# Altium project master.PrjPcb (part 3 of 3)

## Sheet isolated_rs485.SchDoc: foxBMS BMS-Extension
size A3; DocumentNumber: 9; SheetNumber: 9; SheetTotal: 14; Author: Fraunhofer IISB foxBMS Team; REL-DATE: 2017-05-16; VERSION: 1.0.2; GateName_1: G$1; SymbolName_1: FRAME_B_L; LibraryName: foxBMS_BMS-Master_V1.00_A; DeviceSetName: FRAME_B_L; GateName_2: G$2; SymbolName_2: DOCFIELD; SheetDescription: Isolated RS485
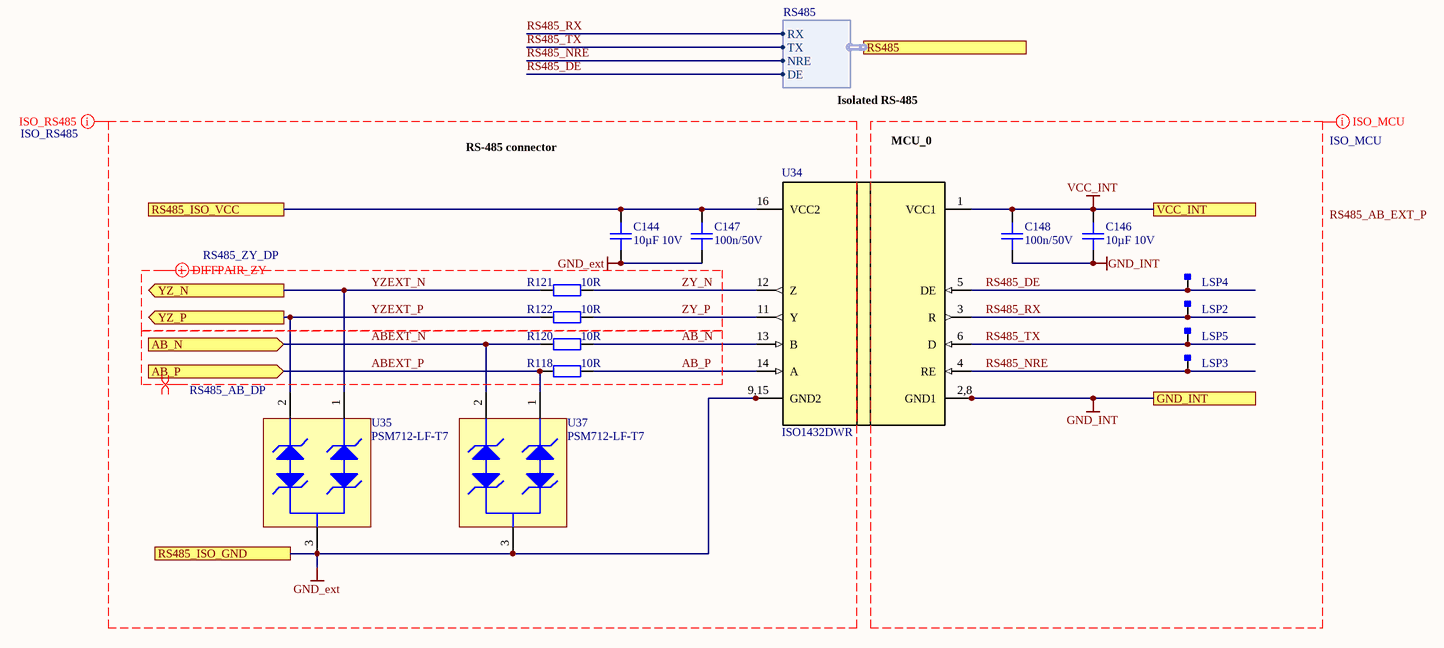
[diagram p13: isolated_rs485.SchDoc]

### Parts
C144  10µF 10V  [0805C]
C146  10µF 10V  [0805C]
C147  100n/50V  [0603C]
C148  100n/50V  [0603C]
LSP2  Testpoint_Square  [Testpoint_S1]  (value not drawn)  (no BOM)
LSP3  Testpoint_Square  [Testpoint_S1]  (value not drawn)  (no BOM)
LSP4  Testpoint_Square  [Testpoint_S1]  (value not drawn)  (no BOM)
LSP5  Testpoint_Square  [Testpoint_S1]  (value not drawn)  (no BOM)
R118  10R  [0603R]
R120  10R  [0603R]
R121  10R  [0603R]
R122  10R  [0603R]
U34  ISO1432DWR  [DW0016B_N]
U35  PSM712-LF-T7  [PRKT-SOT23-3_V]
U37  PSM712-LF-T7  [PRKT-SOT23-3_V]

### Ports
AB_N (in), AB_P (in), GND_INT, RS485 (harness RS485), RS485_ISO_GND, RS485_ISO_VCC, VCC_INT, YZ_N (out), YZ_P (out)

### Harnesses
RS485: RX, TX, NRE, DE

### Nets
+3.3V_COM: C144.1 C147.1 U34.16(VCC2) ; port RS485_ISO_VCC
GND_ext: C144.2 C147.2 U34.9,15(GND2) U34.15 U35.3 U37.3 ; port RS485_ISO_GND  [project net GND_COM]
GND_INT: C146.2 C148.2 U34.2,8(GND1) U34.8 ; port GND_INT  [project net GND_0]
VCC_INT: C146.1 C148.1 U34.1(VCC1) ; port VCC_INT  [project net +3.3V_0]
AB_N: R120.2 U34.13(B)
AB_P: R118.2 U34.14(A)
ABEXT_N: R120.1 U37.2 ; port AB_N
ABEXT_P: R118.1 U37.1 ; port AB_P
RS485_DE: LSP4.1 U34.5(DE) ; port RS485.DE
RS485_NRE: LSP3.1 U34.4(RE) ; port RS485.NRE  [project net RS485_MCU_0_NRE]
RS485_RX: LSP2.1 U34.3(R) ; port RS485.RX  [project net RS485_MCU_0_RX]
RS485_TX: LSP5.1 U34.6(D) ; port RS485.TX  [project net RS485_MCU_0_TX]
YZEXT_N: R121.1 U35.1 ; port YZ_N  [project net RS485_YZ_N]
YZEXT_P: R122.1 U35.2 ; port YZ_P  [project net RS485_YZ_P]
ZY_N: R121.2 U34.12(Z)
ZY_P: R122.2 U34.11(Y)

Not connected (* = marked no-connect by the designer): U34 7(NC) 10(NC)

### Layout directives
net class ISO_MCU: GND_INT, RS485_DE, RS485_NRE, RS485_RX, RS485_TX, VCC_INT
net class ISO_RS485: AB_N, AB_P, ABEXT_N, ABEXT_P, GND_ext, YZEXT_N, YZEXT_P, ZY_N, ZY_P
differential pair; differential pair class RS485_ZY_DP: YZEXT_N, YZEXT_P, ZY_N, ZY_P
differential pair; differential pair class RS485_AB_DP: AB_N, AB_P, ABEXT_N, ABEXT_P

### Notes on the sheet
- Isolated RS-485
- RS-485 connector
- MCU_0
- Labels drawn without touching a wire or pin: RS485_AB_EXT_P
- Fraunhofer IISB
- Schottkystr. 10
- developed by:
- 91058 Erlangen
- Germany
- Author
- Project
- License
- Description
- File
- Version
- Release Date
- Sheet
- www.foxbms.org
- www.iisb.fraunhofer.de
- foxBMS Team
- /

### Library data of the parts
C144 C146 = gen_C_ceramic_10u_10V_X7R_0805: Ceramic, 10µF, ±10%, 10V, X7R, –55 to 125°C, 0805 (2012),RoHS, Automotive; Part Number: GCJ21BR71A106KE01; Manufacturer: Murata; Case EIA: 0805; Case Metric: 2012; Automotive Qualified: True; PnP Package: C_0805_10; PnP Value: 10µF/10V/X7R; Capacitance: 10µF; Rated Voltage: 10V; Dielectric: X7R; Supplier 1: Digi-Key; Supplier Part Number 1: 490-12646-1-ND; Height - Seated (Max): 1.25mm; Mounting Type: SurfaceMount,MLCC; Operating Temperature: –55 to 125°C; Series: GCJ; Tolerance: ±10%; Manufacturer_Part_Number: GCJ21BR71A106KE01
C147 C148 = gen_C_ceramic_100n_50V_X7R_0603: MLCC; Capacitance: 100n; Rated Voltage: 50V; Dielectric: X7R; Case EIA: 0603; Case Metric: 1608; PnP Package: C_0603_10; PnP Value: 100n/50V/X7R; PnP equipped: x; Part Number: gen_C_ceramic_100n_50V_X7R_0603; Supplier 1: Farnell; Supplier Part Number 1: 2525267
LSP2-LSP5 = Testpoint_Square: Testpoint, square; Part Number: Testpoint_Square
R118 R120-R122 = gen_R_10R_0603: SMD Resistor 10R 0603; Tolerance: 1%; Power: 0.1W; Case EIA: 0603; Case Metric: 1608; Maximum Working Voltage: 75V; PnP Package: R_0603; Automotive Qualified: False; Part Number: gen_R_10R_0603; Operating Temperature: -55°C - +155°C; Resistance: 10R; Series: E24, E96; PnP Value: 10R; Supplier 1: Farnell; Supplier Part Number 1: 2073361
U34 = ISO1432DWR: 5-kVrms isolated RS-485/RS-422 transceiver with robust EMC; Manufacturer: Texas Instruments; PartNumber: ISO1432DWR; RefDes: RefDes; TYPE: TYPE; Value: Value; Part Number: ISO1432DWR
U35 U37 = CMP-2000-07553-1: TVS Array - Asymmetrical Data Line Protector, 600 W, 7.5 V, -55 to 150 degC, 3-Pin SOT23, RoHS, Tape and Reel; Manufacturer: Protek Devices; Min Breakdown Voltage: 7.5V; Direction: Bidirectional; Capacitance: 75pF; Current: 20uA; Power Dissipation: 600W; Working Voltage: 7V; Voltage: 12V; Case\/Package: SOT-23; Clamping Voltage: 17V; Element Configuration: Dual; Mounting Technology: SurfaceMount; RoHSCompliant: True; Radiation Hardening: No; Depth: 1.4mm; Lead Free: LeadFree; Package Description: 3-Pin Small Outline Transistor, Body 2.92 x 1.3 mm, Pitch 0.94 mm; Max Operating Temperature: 150degC; Length: 3.04mm; Manufacturer URL: http://www.protekdevices.com/; Min Operating Temperature: -55degC; Leakage Current: 20uA; Datasheet URL: www.protekdevices.com/xyz/documents/datasheets/psm712.pdf; Packaging: TapeandReel; Datasheet Version: 10/2013; Package Reference: SOT23-3; Number of Pins: 3

## Sheet dcdc_wide_3v3.SchDoc
size 379 x 125 mm; SheetNumber: 1; SheetTotal: 1
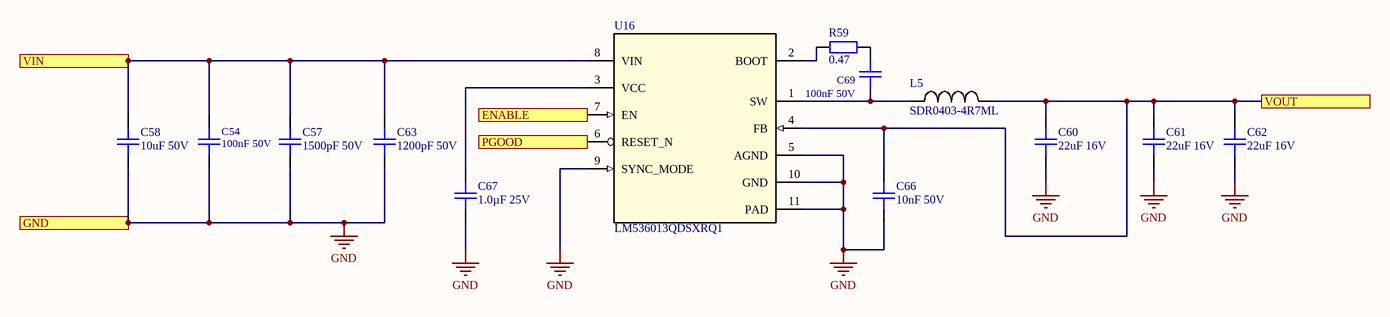
[diagram p14: dcdc_wide_3v3.SchDoc]

### Parts
C54  100nF 50V  [0805C]
C57  1500pF 50V  [0402C]
C58  10uF 50V  [CAPC3225X279X50LL20T25]
C60  22uF 16V  [1210C]
C61  22uF 16V  [1210C]
C62  22uF 16V  [1210C]
C63  1200pF 50V  [0402C]
C66  10nF 50V  [0402C]
C67  1.0µF 25V  [0603C]
C69  100nF 50V  [0805C]
L5  SDR0403-4R7ML  [SDR0403]
R59  0.47  [0402R]
U16  LM536013QDSXRQ1  [DSX0010A]

### Ports
ENABLE, GND, PGOOD, VIN, VOUT

### Nets
GND: C54.1 C57.1 C58.1 C60.1 C61.1 C62.1 C63.1 C66.1 C67.1 U16.5(AGND) U16.9(SYNC_MODE) U16.10(GND) U16.11(PAD) ; port GND
NetC54_2: C54.2 C57.2 C58.2 C63.2 U16.8(VIN) ; port VIN
NetC60_2: C60.2 C61.2 C62.2 C66.2 L5.2 U16.4(FB) ; port VOUT
NetC67_2: C67.2 U16.3(VCC)
NetC69_1: C69.1 L5.1 U16.1(SW)
NetC69_2: C69.2 R59.2
NetR59_1: R59.1 U16.2(BOOT)
NetU16_6: U16.6(RESET_N) ; port PGOOD
NetU16_7: U16.7(EN) ; port ENABLE

### Library data of the parts
C54 = gen_C_ceramic_100n_50V_X7R_0805: Ceramic, 100nF, ±20%, 50V, X7R, –55 to 125°C, 0805 (2012),RoHS, Automotive; Manufacturer: Murata; Capacitance: 100n; Case EIA: 0805; Case Metric: 2012; Automotive Qualified: True; PnP Package: C_0805_10; Tolerance: ±10%; Dielectric: X7R; Rated Voltage: 50V; Height - Seated (Max): 0.8mm; Mounting Type: SurfaceMount,MLCC; Operating Temperature: –55 to 125°C; Series: GCJ; Supplier 1: Element14; Supplier Part Number 1: 8820120
C57 = gen_C_ceramic_390p_25V_C0G_0402: Ceramic, 390pF, ±5%, 25V, C0G, 25 to 125°C, 0402 (1005),RoHS, Automotive; Manufacturer: Murata; Capacitance: 1500p; Case EIA: 0402; Case Metric: 1005; Automotive Qualified: True; PnP Package: C_0402_10; PnP Value: 1500p/50V/C0G; Rated Voltage: 50V; Dielectric: C0G; Supplier 1: Digi-Key; Height - Seated (Max): 0.5mm; Mounting Type: SurfaceMount,MLCC; Operating Temperature: 25 to 125°C; Series: GCM; Tolerance: ±5%
C58 = gen_C_ceramic_10u_50V_X7R_1210: Ceramic, 10uF, 50 V, -55 to 125 degC, 2-Pin SMD (1210), RoHS, Tape and Reel; Manufacturer: AVX; Manufacturer 1: Kyocera AVX; Manufacturer Part Number 1: 12105C106KAT2A; Dielectric: X7R; Tolerance: ±10%; Load Life: 1000h; Type: CommercialSurfaceMountChip; Temperature Coefficient / Code: +/-15%; Case EIA: 1210; Case Metric: 3225; PnP Package: C_1210_10; PnP Value: 10µF/25V/X7R; Rated Voltage: 25V; Maximum Operating Temperature: +125C; Mounting Technology: SurfaceMount; Case Code - in: 1210; Package Description: 2-Pin Surface Mount Device, Body 3.2 x 2.5 mm; Datasheet URL: http://www.farnell.com/datasheets/1818074.pdf; Case Code - mm: 3225; Package / Case: 1210(3225metric); Product: GeneralTypeMLCCs; Capacitance: 10uF; Product Category: MultilayerCeramicCapacitorsMLCC-SMD/SMT; Minimum Operating Temperature: -55C; Manufacturer URL: http://www.avx.com/; Operating Temperature Range: -55Cto+125C; Termination Style: SMD/SMT; Voltage Rating: 50V; Factory Pack Quantity: 1000; RoHS: Details; Brand: AVX; Datasheet Version: 03/2014; Package Reference: 1210; Packaging: Reel; Voltage Rating DC: 50V; Height - Seated (Max): 2.5mm; Mounting Type: SurfaceMount,MLCC; Operating Temperature: –55 to 125°C; Series: GCM
C60-C62 = gen_C_ceramic_22u_16V_X7R_1210: Ceramic, 22uF, 16 V, -55 to 125 degC, 2-Pin SMD (1210), RoHS, Tape and Reel; Manufacturer: AVX; Manufacturer 1: Kyocera AVX; Manufacturer Part Number 1: 12105C106KAT2A; Dielectric: X7R; Tolerance: ±10%; Capacitance: 10uF; Load Life: 1000h; Type: CommercialSurfaceMountChip; Voltage Rating: 50V; Temperature Coefficient / Code: +/-15%; Case EIA: 1210; Case Metric: 3225; PnP Package: C_1210_10; PnP Value: 22µF/16V/X7R; Maximum Operating Temperature: +125C; Mounting Technology: SurfaceMount; Case Code - in: 1210; Package Description: 2-Pin Surface Mount Device, Body 3.2 x 2.5 mm; Datasheet URL: http://www.farnell.com/datasheets/1818074.pdf; Case Code - mm: 3225; Package / Case: 1210(3225metric); Product: GeneralTypeMLCCs; Product Category: MultilayerCeramicCapacitorsMLCC-SMD/SMT; Minimum Operating Temperature: -55C; Manufacturer URL: http://www.avx.com/; Operating Temperature Range: -55Cto+125C; Termination Style: SMD/SMT; Factory Pack Quantity: 1000; RoHS: Details; Brand: AVX; Datasheet Version: 03/2014; Package Reference: 1210; Packaging: Reel; Voltage Rating DC: 50V; Height - Seated (Max): 2.5mm; Mounting Type: SurfaceMount,MLCC; Operating Temperature: –55 to 125°C; Rated Voltage: 16V; Series: GCM
C63 = gen_C_ceramic_390p_25V_C0G_0402: Ceramic, 390pF, ±5%, 50V, C0G, 25 to 125°C, 0402 (1005),RoHS, Automotive; Manufacturer: Murata; Capacitance: 1200p; Case EIA: 0402; Case Metric: 1005; Automotive Qualified: True; PnP Package: C_0402_10; PnP Value: 1200pF/50V/C0G; Rated Voltage: 50V; Dielectric: C0G; Supplier 1: Digi-Key; Height - Seated (Max): 0.5mm; Mounting Type: SurfaceMount,MLCC; Operating Temperature: 25 to 125°C; Series: GCM; Tolerance: ±5%
C66 = gen_C_ceramic_10n_50V_X7R_0402: Ceramic, 10nF, ±10%, 50V, X7R, –55 to 125°C, 0402 (1005),RoHS, Automotive; Part Number: GRT155R71H104KE01; Automotive Qualified: True; Capacitance: 10n; Case EIA: 0402; Case Metric: 1005; PnP Package: C_0402_10; PnP Value: 10n/50V/X7R; Dielectric: X7R; Rated Voltage: 50V
C67 = gen_C_ceramic_1u_25V_X7R_0603: Ceramic, 1.0µF, ±10%, 25V, X7R, –55 to 125°C, 0603 (1608),RoHS, Automotive; Part Number: GCJ188R71E105KA01; Manufacturer: Murata; Case EIA: 0603; Case Metric: 1608; Capacitance: 1µF; Automotive Qualified: True; PnP Package: C_0603_10; PnP Value: 1.0µF/25V/X7R; Dielectric: X7R; Rated Voltage: 25V; Height - Seated (Max): 0.8mm; Mounting Type: SurfaceMount,MLCC; Operating Temperature: –55 to 125°C; Series: GCJ; Tolerance: ±10%; Manufacturer_Part_Number: GCJ188R71E105KA01; Supplier 1: Digi-Key; Supplier Part Number 1: 490-14409-1-ND
C69 = gen_C_ceramic_100n_50V_X7R_0805: Ceramic, 100nF, ±20%, 50V, X7R, –55 to 125°C, 0805 (2012),RoHS, Automotive; Part Number: GCJ188R71H104KA12; Manufacturer: Murata; Capacitance: 100n; Case EIA: 0603; Case Metric: 1608; Automotive Qualified: True; PnP Package: C_0603_10; PnP Value: 100nF/50V/X7R; Tolerance: ±10%; Dielectric: X7R; Rated Voltage: 50V; Height - Seated (Max): 0.8mm; Mounting Type: SurfaceMount,MLCC; Operating Temperature: –55 to 125°C; Series: GCJ; Manufacturer_Part_Number: GCJ188R71H104KA12; Supplier 1: Digi-Key; Supplier Part Number 1: 490-5798-1-ND
L5 = SDR0403-4R7ML: 4.7uH; Vendor: Bourns; Manufacturer_Part_Number: SDR0403-4R7ML; Manufacturer_Name: Bourns; RefDes: RefDes; TYPE: TYPE; Value: Value
R59 = gen_R_0R_0402: SMD Resistor 0R47 0402; Part Number: gen_R_0R47_0402; Case EIA: 0402; Case Metric: 1005; PnP Package: R_0402; Automotive Qualified: False; PnP Value: 0R47; Operating Temperature: -55°C - +155°C
U16 = LM536013QDSXRQ1: Imported; Manufacturer: Texas Instruments; CompType: IC; PIN_COUNT: 11; Application_BuildNumber: *; PartNumber: LM536013QDSXRQ1; PackageReference: DSX0010A; MountType: SMT; RoHS: Y; RefDes: RefDes; TYPE: TYPE; Value: Value; Manufacturer_Part_Number: LM536013QDSXRQ1; Manufacturer_Name: Texas Instruments

## Sheet bms-slave-magnetics.SchDoc: foxBMS BMS-Interface
size A3; DocumentNumber: 4; SheetNumber: 4; SheetTotal: 6; Author: Fraunhofer IISB foxBMS Team; REL-DATE: 2017-05-09; VERSION: 1.1.0; GateName_1: G$1; SymbolName_1: FRAME_B_L; LibraryName: foxBMS_BMS-Master_V1.00_A; DeviceSetName: FRAME_B_L; GateName_2: G$2; SymbolName_2: DOCFIELD; SheetDescription: Daisy Chain Isolation
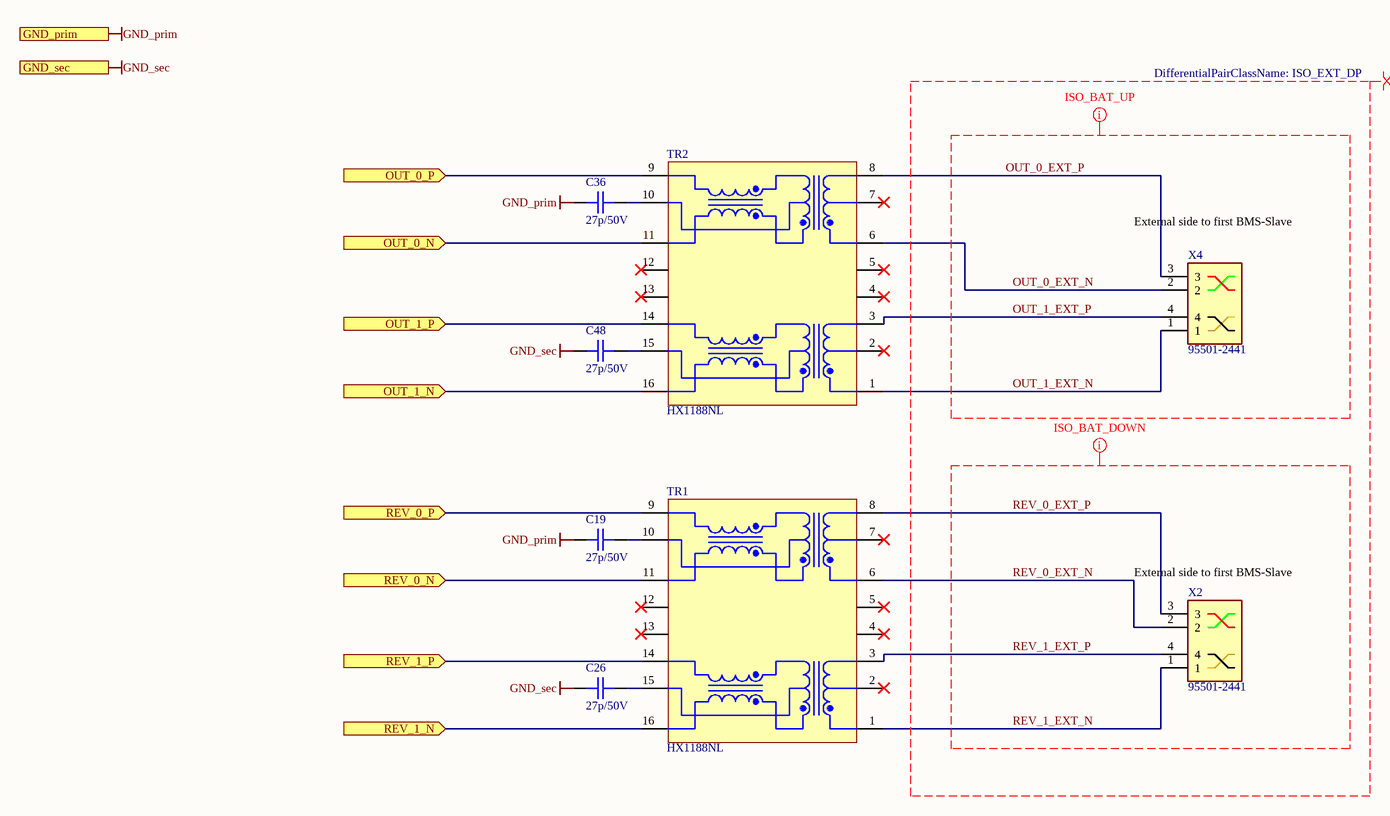
[diagram p15: bms-slave-magnetics.SchDoc]

### Parts
C19  27p/50V  [0603C]
C26  27p/50V  [0603C]
C36  27p/50V  [0603C]
C48  27p/50V  [0603C]
TR1  HX1188NL  [PULS-MODULE-16_V]
TR2  HX1188NL  [PULS-MODULE-16_V]
X2  95501-2441  [95501-2441]
X4  95501-2441  [95501-2441]

### Ports
GND_prim, GND_sec, OUT_0_N (in), OUT_0_P (in), OUT_1_N (in), OUT_1_P (in), REV_0_N (in), REV_0_P (in), REV_1_N (in), REV_1_P (in)

### Nets
GND_prim: C19.2 C36.2 ; port GND_prim
GND_sec: C26.1 C48.1 ; port GND_sec
OUT_0_EXT_N: TR2.6 X4.2
OUT_0_EXT_P: TR2.8 X4.3
OUT_1_EXT_N: TR2.1 X4.1
OUT_1_EXT_P: TR2.3 X4.4
REV_0_EXT_N: TR1.6 X2.2
REV_0_EXT_P: TR1.8 X2.3
REV_1_EXT_N: TR1.1 X2.1
REV_1_EXT_P: TR1.3 X2.4
NetC19_1: C19.1 TR1.10
NetC26_2: C26.2 TR1.15
NetC36_1: C36.1 TR2.10
NetC48_2: C48.2 TR2.15
NetTR1_9: TR1.9 ; port REV_0_P
NetTR1_11: TR1.11 ; port REV_0_N
NetTR1_14: TR1.14 ; port REV_1_P
NetTR1_16: TR1.16 ; port REV_1_N
NetTR2_9: TR2.9 ; port OUT_0_P
NetTR2_11: TR2.11 ; port OUT_0_N
NetTR2_14: TR2.14 ; port OUT_1_P
NetTR2_16: TR2.16 ; port OUT_1_N

Not connected (* = marked no-connect by the designer): TR1 2* 4* 5* 7* 12* 13*; TR2 2* 4* 5* 7* 12* 13*

### Layout directives
net class ISO_BAT; net class ISO_BAT_UP: OUT_0_EXT_N, OUT_0_EXT_P, OUT_1_EXT_N, OUT_1_EXT_P
net class ISO_BAT; net class ISO_BAT_DOWN: REV_0_EXT_N, REV_0_EXT_P, REV_1_EXT_N, REV_1_EXT_P
differential pair; differential pair class ISO_EXT_DP: OUT_0_EXT_N, OUT_0_EXT_P, OUT_1_EXT_N, OUT_1_EXT_P, REV_0_EXT_N, REV_0_EXT_P, REV_1_EXT_N, REV_1_EXT_P

### Notes on the sheet
- (near X4) External side to first BMS-Slave
- (near X2) External side to first BMS-Slave
- Fraunhofer IISB
- Schottkystr. 10
- developed by:
- 91058 Erlangen
- Germany
- Author
- Project
- License
- Description
- File
- Version
- Release Date
- Sheet
- www.foxbms.org
- www.iisb.fraunhofer.de
- foxBMS Team
- /

### Library data of the parts
C19 C26 C36 C48 = gen_C_ceramic_27p_50V_NP0_0603: MLCC; Capacitance: 27p; Rated Voltage: 50V; Dielectric: NP0; Case EIA: 0603; Case Metric: 1608; PnP Package: C_0603_05; Automotive Qualified: True; Part Number: gen_C_ceramic_27p_50V_NP0_0603; Supplier 1: Farnell; Supplier Part Number 1: 2219430; PnP Value: *
TR1 TR2 = CMP-2000-05323-1: 10/100 Base-T Single Port Surface Mount Magnetic with Turns Ratio, -40 to 85 degC, 16-Pin Module, RoHS, Tube; Manufacturer: Pulse Electronics; Other Related Documents: PackagesFNLvs.NL; Other Names: 553-1340; PCN Design/Specification: ThermoplasticHeaderDesign28/Jun/2013; Transformer Type: IsolationandDataInterface(Encapsulated); PCN Other: HaloInjunctionRes1/Sep/2015; Turns Ratio - Primary: Secondary:1:1Transmitter,1:1Receiver; Family: PulseTransformers; Datasheet URL: https://datasheet.ciiva.com/26929/hx1188nl-26929858.pdf; Mounting Type: SurfaceMount; Size / Dimension: 12.70mmLx7.11mmW; Inductance: -; Package Description: 16-Pin Surface Mount Device, Body 12.7 x 7.11 mm, Pitch 1.27 mm; Height - Seated (Max): 6.22mm; E.T.: -; Online Catalog: 10/100BASE-TSinglePort; Manufacturer URL: http://www.pulseelectronics.com/; Package Reference: MODULE-16; Series: -; Category: Transformers; Standard Package: 40; Datasheet Version: Rev. H325.Q, 09/2009
X2 X4 = 95501-2441: Connector; Manufacturer_Name: Molex; Allied_Number: 70372436; Datasheet Link: http://www.molex.com/webdocs/datasheets/pdf/en-us/0955012441_MODULAR_JACKS_PLUG.pdf; Manufacturer_Part_Number: 95501-2441; Mouser Part Number: 538-95501-2441; Mouser Price/Stock: https://www.mouser.com/Search/Refine.aspx?Keyword=538-95501-2441; RS Part Number: 2400913; RS Price/Stock: https://uk.rs-online.com/web/p/products/2400913; Allied Price/Stock: http://www.alliedelec.com/molex-incorporated-95501-2441/70372436/

## Sheet 0301_LTC6820_chip.SchDoc
size A3; DocumentNumber: 6; SheetNumber: 6; SheetTotal: 6; SheetDescription: LTC6820
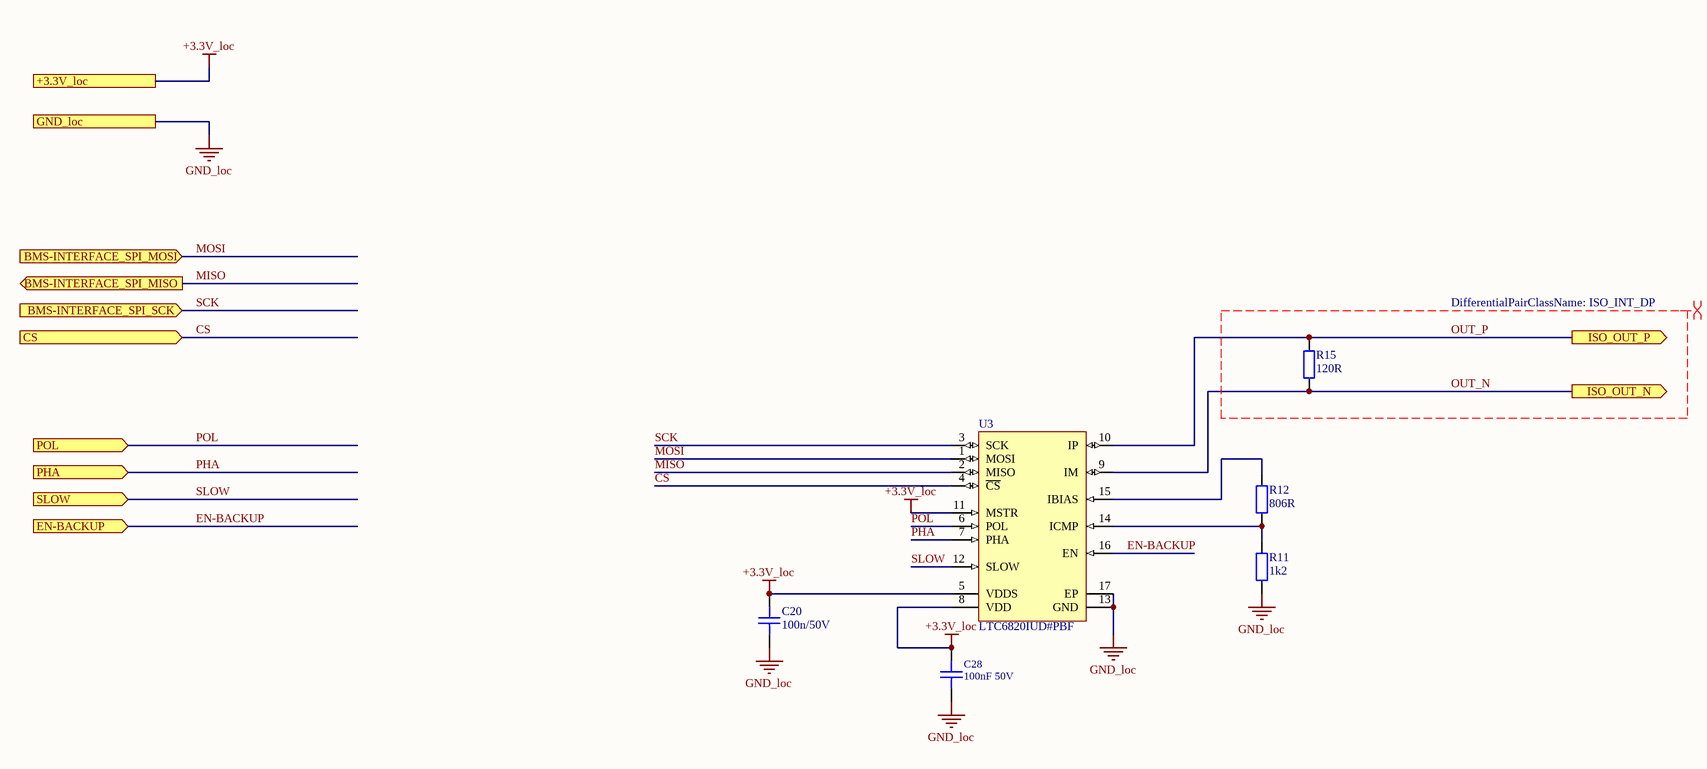
[diagram p16: 0301_LTC6820_chip.SchDoc]

### Parts
C20  100n/50V  [0603C]
C28  100nF 50V  [0603C]
R11  1k2  [0603R]
R12  806R  [0603R]
R15  120R  [0603R]
U3  LTC6820IUD#PBF  [LT-UD-16-EPV-AA_L]

### Ports
+3.3V_loc, BMS-INTERFACE_SPI_MISO (out), BMS-INTERFACE_SPI_MOSI (in), BMS-INTERFACE_SPI_SCK (in), CS (in), EN-BACKUP (in), GND_loc, ISO_OUT_N (out), ISO_OUT_P (out), PHA (in), POL (in), SLOW (in)

### Nets
+3.3V_loc: C20.2 C28.2 U3.5(VDDS) U3.8(VDD) U3.11(MSTR) ; port +3.3V_loc
GND_loc: C20.1 C28.1 R11.1 U3.13(GND) U3.17(EP) ; port GND_loc
CS: U3.4(~{CS}) ; port CS
EN-BACKUP: U3.16(EN) ; port EN-BACKUP
MISO: U3.2(MISO) ; port BMS-INTERFACE_SPI_MISO
MOSI: U3.1(MOSI) ; port BMS-INTERFACE_SPI_MOSI
OUT_N: R15.1 U3.9(IM) ; port ISO_OUT_N
OUT_P: R15.2 U3.10(IP) ; port ISO_OUT_P
PHA: U3.7(PHA) ; port PHA
POL: U3.6(POL) ; port POL
SCK: U3.3(SCK) ; port BMS-INTERFACE_SPI_SCK
SLOW: U3.12(SLOW) ; port SLOW
NetR11_2: R11.2 R12.1 U3.14(ICMP)
NetR12_2: R12.2 U3.15(IBIAS)

### Layout directives
differential pair; differential pair class ISO_INT_DP: OUT_N, OUT_P

### Notes on the sheet
- Fraunhofer IISB
- Schottkystr. 10
- developed by:
- 91058 Erlangen
- Germany
- Author
- Project
- License
- Description
- File
- Version
- Release Date
- Sheet
- www.foxbms.org
- www.iisb.fraunhofer.de
- foxBMS Team
- /

### Library data of the parts
C20 = gen_C_ceramic_100n_50V_X7R_0603: MLCC; Capacitance: 100n; Rated Voltage: 50V; Dielectric: X7R; Case EIA: 0603; Case Metric: 1608; PnP Package: C_0603_10; PnP Value: 100n/50V/X7R; PnP equipped: x; Automotive Qualified: True; Part Number: gen_C_ceramic_100n_50V_X7R_0603; Supplier 1: Farnell; Supplier Part Number 1: 2525267; Supplier 2: Digikey; Supplier Part Number 2: 490-6049-1-ND; Supplier 3: Farnell; Supplier Part Number 3: 2070398
C28 = gen_C_ceramic_100n_50V_X7R_0603: Ceramic, 100nF, ±10%, 50V, X7R, –55 to 125°C, 0603 (1608),RoHS, Automotive; Part Number: GCJ188R71H104KA12; Manufacturer: Murata; Capacitance: 100n; Case EIA: 0603; Case Metric: 1608; PnP Package: C_0603_10; PnP Value: 100nF/50V/X7R; Automotive Qualified: True; Rated Voltage: 50V; Dielectric: X7R; Supplier 1: Digi-Key; Supplier Part Number 1: 490-5798-1-ND; Height - Seated (Max): 0.8mm; Mounting Type: SurfaceMount,MLCC; Operating Temperature: –55 to 125°C; Series: GCJ; Tolerance: ±10%; Manufacturer_Part_Number: GCJ188R71H104KA12
R11 = gen_R_1k2_0603: SMD Resistor 1k2 0603; Tolerance: 1%; Power: 0.1W; Case EIA: 0603; Case Metric: 1608; Maximum Working Voltage: 75V; PnP Package: R_0603; Automotive Qualified: True; Part Number: gen_R_1k2_0603; Operating Temperature: -55°C - +155°C; Resistance: 1k2; Series: E24; PnP Value: 1k2; Supplier 1: Farnell; Supplier Part Number 1: 2073370
R12 = gen_R_806R_0603: SMD Resistor 806R 0603; Tolerance: 1%; Power: 0.1W; Case EIA: 0603; Case Metric: 1608; Maximum Working Voltage: 75V; PnP Package: R_0603; Automotive Qualified: True; Part Number: gen_R_806R_0603; Operating Temperature: -55°C - +155°C; Resistance: 806R; Series: E96; PnP Value: 806R; Supplier 1: Farnell; Supplier Part Number 1: 2059324
R15 = gen_R_120R_0603: SMD Resistor 120R 0603; Tolerance: 1%; Power: 0.1W; Case EIA: 0603; Case Metric: 1608; Maximum Working Voltage: 75V; PnP Package: R_0603; Automotive Qualified: True; Part Number: gen_R_120R_0603; Operating Temperature: -55°C - +155°C; Resistance: 120R; Series: E24; PnP Value: 120R; Supplier 1: Farnell; Supplier Part Number 1: 1652832
U3 = CMP-0937-00013-1: IsoSPI Isolated Communication Interface, 2.7 to 5.5 V, -40 to 85 degC, 16-Pin QFN (UD-16EPV-AA), Pb-Free; Manufacturer: Linear Technology; VBIAS: 1.9 to 2.1 V; Receiver Input Resistance: 35 kOhm; IO Supply Voltage Range: 1.7 to 5.5 V; IO Supply Current: 1 uA Max.; Supply Current, IDLE State: 2 uA; ComponentLink3URL: http://cds.linear.com/docs/en/packaging/QFN_16_05-08-1700.pdf; PackageReference: UD-16EPV-AA; ComponentLink1URL: http://www.linear.com/; PartNumber: LTC6820IUD#PBF; Temperature Range (degC): -40 to 85; Mounting Technology: Surface Mount; PackageDescription: 16-Pin Quad Flat No-lead Package, Body 3 x 3 mm, Pitch 0.5 mm; DatasheetVersion: Rev. A; ComponentLink2Description: Datasheet; ComponentLink1Description: Manufacturer URL; PackageVersion: Rev. A; Power Supply: 2.7 to 5.5 V; ComponentLink2URL: http://cds.linear.com/docs/en/datasheet/6820fa.pdf; ComponentLink3Description: Package Specification

## Sheet IsoDcDc-BSR033A.SchDoc: LM5180EVM-S05 Buck Converter Schematic
size 431 x 279 mm; Date: Not shown in title block; ApprovedBy: Not shown in title block; CheckedBy: Not shown in title block; Author: Not shown in title block; CompanyName: Not shown in title block; DrawnBy: K Nielson; Engineer: Not shown in title block; Organization: Not shown in title block; Address1: Not shown in title block; Address2: Not shown in title block; Address3: Not shown in title block; Address4: Not shown in title block; DocumentNumber: 1; Revision: Use project parameter SCH_Rev; SheetNumber: 1; SheetTotal: 2; PageSetup: Record=PageOptions|CenterHorizontal=True|CenterVertical=True|PrintScale=1.00|XCorrection=1.00|YCorrection=1.00|PrintKind=0|BorderSize=5000000|LeftOffset=0|BottomOffset=0|Orientation=2|PaperLength=1000|PaperWidth=1000|Scale=100|PaperSource=15|PrintQuality=600|MediaType=1|DitherType=10|PaperKind=Letter|PrintScaleMode=1; CurrentTime: Not shown in title block; CurrentDate: Not shown in title block; Time: Not shown in title block; DocumentFullPathAndName: Not shown in title block; DocumentName: Not shown in title block; ModifiedDate: Not shown in title block; ImagePath: Not shown in title block
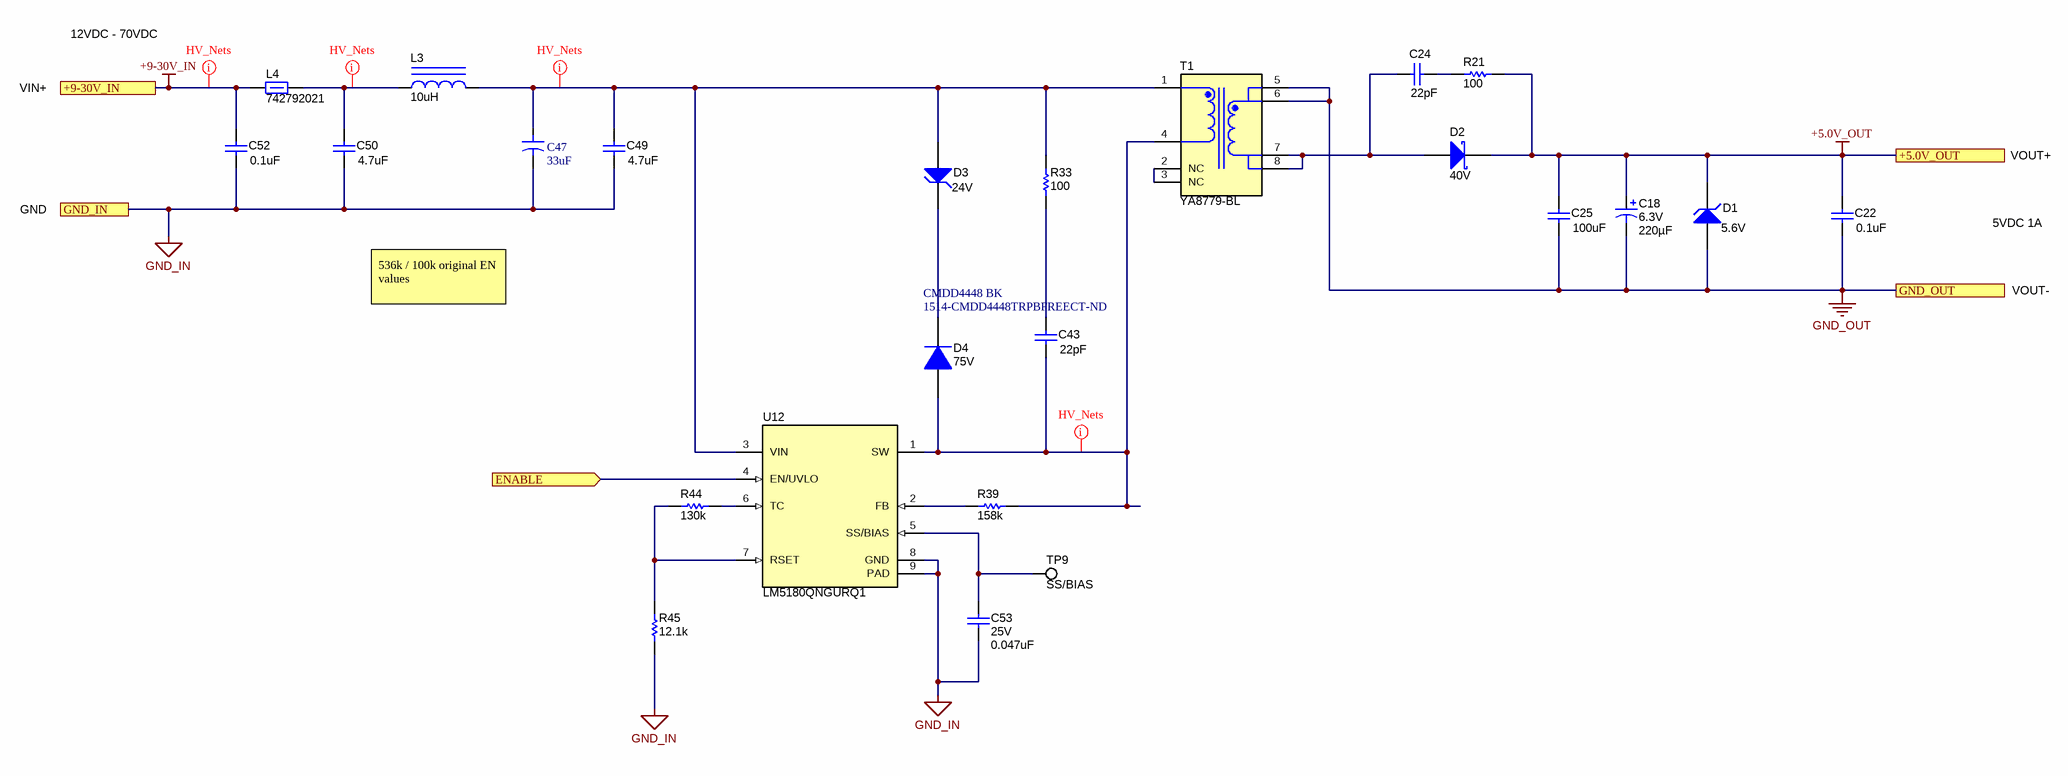
[diagram p17: IsoDcDc-BSR033A.SchDoc]

### Parts
C18  VDC_V: 6.3V  ValueDisplayed: 220µF  [7343-31]  (hidden comment: T598D107M010ATE025)
C22  ValueDisplayed: 0.1uF  [0603C]  (hidden comment: GRM188R72A104KA35J)
C24  ValueDisplayed: 22pF  [0603C]  (hidden comment: GRM1885C2A220JA01D)
C25  ValueDisplayed: 100uF  [1210C]  (hidden comment: GRM32EC80J107ME20L)
C43  ValueDisplayed: 22pF  [0603C]  (hidden comment: GRM1885C2A220JA01D)
C47  value 33uF  [CAPC7343X430M]  (hidden comment: CAP TANTALUM 33UF 50V 2917)
C49  ValueDisplayed: 4.7uF  [1210C]  (hidden comment: GRM32DC72A475KE01L)
C50  ValueDisplayed: 4.7uF  [1210C]  (hidden comment: GRM32DC72A475KE01L)
C52  ValueDisplayed: 0.1uF  [0603C]  (hidden comment: GRM188R72A104KA35J)
C53  VDC_V: 25V  ValueDisplayed: 0.047uF  [0603C]  (hidden comment: GCM188R71E473KA37D)
D1  Vz_V: 5.6V  [SOD-323]  (hidden comment: MMSZ5232BS-7-F)
D2  40V  [SMAF]
D3  Vz_V: 24V  [PowerDI123]  (hidden comment: DFLZ24-7)
D4  75V  Supplier Part Number 1: 1514-CMDD4448TRPBFREECT-ND  Supplier Part Number 2: CMDD4448 BK  [SOD-323]
L3  ValueDisplayed: 10uH  [WE-TPC-M1]  (hidden comment: 744042100)
L4  742792021  [0805_HV]
R21  ValueDisplayed: 100  [0603R]  (hidden comment: CRCW0603100RFKEA)
R33  ValueDisplayed: 100  [0603R]  (hidden comment: CRCW0603100RFKEA)
R39  ValueDisplayed: 158k  [0603R]  (hidden comment: CRCW0603158KFKEA)
R44  ValueDisplayed: 130k  [0603R]  (hidden comment: CRCW0603130KFKEA)
R45  ValueDisplayed: 12.1k  [0603R]  (hidden comment: CRCW060312K1FKEA)
T1  YA8779-BL  [Coilcraft_YA8779-CL]
TP9  SS/BIAS  [Testpoint_Keystone_Miniature]
U12  LM5180QNGURQ1  [NGU0008C]

### Ports
+5.0V_OUT, +9-30V_IN, ENABLE (in), GND_IN, GND_OUT

### Nets
+5.0V_OUT: C18.1(+) C22.1 C25.1 D1.1(K) D2.1(K) R21.1 ; port +5.0V_OUT
+9-30V_IN: C52.1 L4.1 ; port +9-30V_IN
GND_IN: C47.2 C49.1 C50.1 C52.2 C53.2 R45.1 U12.8(GND) U12.9(PAD) ; port GND_IN
GND_OUT: C18.2(-) C22.2 C25.2 D1.2(A) T1.5 T1.6 ; port GND_OUT
NetC24_1: C24.1 R21.2
NetC24_2: C24.2 D2.2(A) T1.7 T1.8
NetC43_1: C43.1 R33.1
NetC43_2: C43.2 D4.2(A) R39.2 T1.4 U12.1(SW)
NetC47_1: C47.1 C49.2 D3.2(A) L3.2 R33.2 T1.1 U12.3(VIN)
NetC50_2: C50.2 L3.1 L4.2
NetC53_1: C53.1 TP9.1 U12.5(SS/BIAS)
NetD3_1: D3.1(K) D4.1(K)
NetR39_1: R39.1 U12.2(FB)
NetR44_1: R44.1 R45.2 U12.7(RSET)
NetR44_2: R44.2 U12.6(TC)
NetT1_2: T1.2(NC) T1.3(NC)
NetU12_4: U12.4(EN/UVLO) ; port ENABLE

### Layout directives
net class HV_Nets: +9-30V_IN, NetC43_2, NetC47_1, NetC50_2

### Notes on the sheet
- 12VDC - 70VDC
- VIN+
- GND
- VOUT+
- 5VDC 1A
- 536k / 100k original EN values
- VOUT-
- Drawn By:
- SVN Rev:
- Number:
- TID #:
- Orderable:
- Rev:
- Sheet Title:
- File:
- Project Title:
- Designed for:
- Assembly Variant:
- Mod. Date:
- Sheet:
- Size:
- of
- B
- http://www.ti.com
- Texas Instruments and/or its licensors do not warrant the accuracy or completeness of this specification or any information contained therein. Texas Instruments and/or its licensors do not warrant that this design will meet the specifications, will be suitable for your application or fit for any particular purpose, or will operate in an implementation. Texas Instruments and/or its licensors do not warrant that the design is production worthy. You should completely validate and test your design implementation to confirm the system functionality for your application.
- Engineer:
- Contact:
- © Texas Instruments

### Library data of the parts
C18 = CMP-0074683-2: CAP, Aluminum Polymer, 220 µF, 6.3 V,+/- 20%, 0.01 ohm, 7343-31 SMD; Manufacturer: MuRata; PartNumber: ECASD60J227M010K00; TaMin_C: -40°C; ESR_ohm: 0.01; Polarized: Y; SizeAreaWB_mm2: 58.59; Value: 220uF; TaMax_C: 105°C; SizeZ_mm: 3.1; SizeX_mm: 7.3; SizeY_mm: 4.3; SizeArea_mm2: 31.39; CompType: Capacitor; AEC Qualified: N; IRMS_A: 3A; AEC Category: Q200; ComponentLink1URL: http://www.murata.com/~/media/webrenewal/support/library/catalog/products/capacitor/polymer/c90e.ashx; Supplier Part Number 2: 11AC3033; Supplier 2: Newark; Supplier Part Number 3: 81-ECASD60J227M010K0; Supplier 3: Mouser; RoHS: Y; Value1: 0.01 ohm; MountType: SMT; Supplier 1: Digi-Key; PackageReference: 7343-31; Tolerance_%: 20%; Cap_Case: 7343-31; Value2: 6.3V; Series: ECAS; Cap_F: 220µF; ComponentLink1Description: Datasheet link; AEC Grade: N/A; Supplier Part Number 1: 490-12529-1-ND; Technology: Aluminum Polymer
C22 C52 = CMP-0007470-5: CAP, CERM, 0.1 uF, 100 V, +/- 10%, X7R, 0603; Manufacturer: MuRata; TaMin_C: -55°C; Polarized: N; SizeAreaWB_mm2: 4.68; Value1: Unknown; U/M: EA; Value: 0.1uF; TaMax_C: 125°C; SizeZ_mm: 1; SizeX_mm: 1.6; SizeY_mm: 0.8; Cap_Case: 0603; Value2: 100V; SizeArea_mm2: 1.28; CompType: Capacitor; Cap_F: 100nF; AEC Category: Q200; Supplier Part Number 2: 81-GRM188R72A104KA5J; Publisher: Texas Instruments; Supplier 2: Mouser; TempCo: X7R; Published: 2008-06-19; RoHS: Y; MountType: SMT; Supplier 1: Digi-Key; PackageReference: 0603; Tolerance_%: 10%; LatestRevisionDate: 2017-03-09; PartNumber: GRM188R72A104KA35J; AEC Qualified: ?; VDC_V: 100V; ComponentLink1Description: Datasheet link; Supplier Part Number 1: 490-6439-1-ND; Technology: Ceramic; ComponentLink1URL: http://search.murata.co.jp/Ceramy/image/img/A01X/G101/ENG/GRM188R72A104KA35-01.pdf
C24 = CMP-0007255-4: CAP, CERM, 22 pF, 100 V, +/- 5%, C0G/NP0, 0603; Manufacturer: MuRata; TaMin_C: -55°C; Polarized: N; SizeAreaWB_mm2: 4.68; U/M: EA; Value: 22pF; TaMax_C: 125°C; SizeZ_mm: 1; SizeX_mm: 1.6; SizeY_mm: 0.8; Cap_Case: 0603; Value2: 100V; SizeArea_mm2: 1.28; CompType: Capacitor; AEC Category: Q200; Value1: Unknown; ComponentLink1URL: http://search.murata.co.jp/Ceramy/PnsearchViewAction.do?HnOFG=ON&HnNFG=ON&SEL_CNT=50&sLang=en&sKey=GRM1885C2A220JA01D&x=9&y=9&search=startwith; Supplier Part Number 2: 81-GRM1885C2A220JA01; Supplier 2: Mouser; TempCo: C0G/NP0; RoHS: Y; MountType: SMT; Supplier 1: Digi-Key; PackageReference: 0603; Tolerance_%: 5%; PartNumber: GRM1885C2A220JA01D; AEC Qualified: ?; Cap_F: 22pF; VDC_V: 100V; ComponentLink1Description: Datasheet link; Supplier Part Number 1: 490-1335-1-ND; Technology: Ceramic; Publisher: Texas Instruments; Published: 2008-06-19; LatestRevisionDate: 2017-03-09
C25 = CMP-0009199-2: CAP, CERM, 100 uF, 6.3 V, +/- 20%, X6S, 1210; Manufacturer: MuRata; TaMin_C: -55°C; Polarized: N; SizeAreaWB_mm2: 14.7; Value1: Unknown; U/M: EA; Value: 100uF; TaMax_C: 105°C; SizeZ_mm: 2.7; SizeX_mm: 3.2; SizeY_mm: 2.5; Cap_Case: 1210; Value2: 6.3V; SizeArea_mm2: 8; Cap_F: 100µF; AEC Category: Q200; Supplier Part Number 2: 81-GRM32EC80J107ME0L; Publisher: Texas Instruments; Supplier 2: Mouser; Supplier Part Number 3: 1889302; TempCo: X6S; Supplier 3: Farnell; Published: 2008-06-19; RoHS: Y; MountType: SMT; Supplier 1: Digi-Key; PackageReference: 1210; Tolerance_%: 20%; CompType: Capacitor; LatestRevisionDate: 2017-03-09; PartNumber: GRM32EC80J107ME20L; AEC Qualified: ?; VDC_V: 6.3V; ComponentLink1Description: Datasheet link; Supplier Part Number 1: GRM32EC80J107ME20L-ND; Technology: Ceramic; ComponentLink1URL: http://search.murata.co.jp/Ceramy/PnsearchViewAction.do?HnOFG=ON&HnNFG=ON&SEL_CNT=50&sLang=en&sKey=GRM32EC80J107ME20L&x=9&y=9&search=startwith
C43 = CMP-0007255-4: CAP, CERM, 22 pF, 100 V, +/- 5%, C0G/NP0, 0603; Manufacturer: MuRata; TaMin_C: -55°C; Polarized: N; SizeAreaWB_mm2: 4.68; Value1: Unknown; U/M: EA; Value: 22pF; TaMax_C: 125°C; SizeZ_mm: 1; SizeX_mm: 1.6; SizeY_mm: 0.8; Cap_Case: 0603; Value2: 100V; SizeArea_mm2: 1.28; CompType: Capacitor; AEC Category: Q200; Supplier Part Number 2: 81-GRM1885C2A220JA01; Supplier 2: Mouser; TempCo: C0G/NP0; RoHS: Y; MountType: SMT; Supplier 1: Digi-Key; PackageReference: 0603; Tolerance_%: 5%; PartNumber: GRM1885C2A220JA01D; AEC Qualified: ?; Cap_F: 22pF; VDC_V: 100V; ComponentLink1Description: Datasheet link; Supplier Part Number 1: 490-1335-1-ND; Technology: Ceramic; ComponentLink1URL: http://search.murata.co.jp/Ceramy/PnsearchViewAction.do?HnOFG=ON&HnNFG=ON&SEL_CNT=50&sLang=en&sKey=GRM1885C2A220JA01D&x=9&y=9&search=startwith; Publisher: Texas Instruments; Published: 2008-06-19; LatestRevisionDate: 2017-03-09
C47 = T521X336M050ATE075: 33µF Molded Tantalum Polymer Capacitor 50V 2917 (7343 Metric) 75mOhm @ 100kHz; Supplier 1: Digi-Key; Supplier Part Number 1: 399-11721-1-ND
C49 C50 = CMP-0009182-2: CAP, CERM, 4.7 uF, 100 V, +/- 10%, X7S, 1210; Manufacturer: MuRata; TaMin_C: -55°C; Polarized: N; SizeAreaWB_mm2: 14.7; Value1: Unknown; U/M: EA; Value: 4.7uF; TaMax_C: 125°C; SizeZ_mm: 2.2; SizeX_mm: 3.2; SizeY_mm: 2.5; Cap_Case: 1210; Value2: 100V; SizeArea_mm2: 8; CompType: Capacitor; Cap_F: 4.7µF; AEC Category: Q200; Publisher: Texas Instruments; TempCo: X7S; Published: 2008-06-19; RoHS: Y; MountType: SMT; Supplier 1: Mouser; PackageReference: 1210; Tolerance_%: 10%; LatestRevisionDate: 2017-03-09; PartNumber: GRM32DC72A475KE01L; AEC Qualified: N; VDC_V: 100V; ComponentLink1Description: Datasheet link; AEC Grade: N/A; Supplier Part Number 1: 81-GRM32DC72A475KE1L; Technology: Ceramic; ComponentLink1URL: http://search.murata.co.jp/Ceramy/image/img/A01X/G101/ENG/GRM32DC72A475KE01-01.pdf
C53 = CMP-0007141-5: CAP, CERM, 0.047 uF, 25 V, +/- 10%, X7R, AEC-Q200 Grade 1, 0603; Manufacturer: MuRata; TaMin_C: -55°C; Polarized: N; SizeAreaWB_mm2: 4.68; Value1: Unknown; U/M: EA; TaMax_C: 125°C; SizeZ_mm: 1; SizeX_mm: 1.6; SizeY_mm: 0.8; Cap_Case: 0603; SizeArea_mm2: 1.28; CompType: Capacitor; AEC Qualified: Y; Cap_F: 47nF; AEC Category: Q200; Supplier Part Number 2: 81-GCM188R71E473KA7D; Publisher: Texas Instruments; Supplier 2: Mouser; TempCo: X7R; Published: 2008-06-19; RoHS: Y; MountType: SMT; Value: 0.047uF; Supplier 1: Digi-Key; PackageReference: 0603; Tolerance_%: 10%; Value2: 25V; LatestRevisionDate: 2017-03-09; PartNumber: GCM188R71E473KA37D; ComponentLink1Description: Datasheet link; Supplier Part Number 1: 490-8018-1-ND; Technology: Ceramic; ComponentLink1URL: http://psearch.murata.com/capacitor/product/GCM188R71E473KA37%23.pdf; AEC Grade: 1
D1 = CMP-0005855-1: Diode, Zener, 5.6 V, 200 mW, SOD-323; Manufacturer: Diodes Inc.; Power_W: 200mW; SizeAreaWB_mm2: 8.695; Value1: 0.2W; RJA_CperW: 350; U/M: EA; Value: 5.6V; SizeZ_mm: 1; SizeX_mm: 2.7; SizeY_mm: 1.35; SizeArea_mm2: 3.645; AEC Category: Q101; ComponentLink1URL: http://www.diodes.com/datasheets/ds31038.pdf; Supplier Part Number 2: 621-MMSZ5232BS-F; Publisher: Texas Instruments; Supplier 2: Mouser; Published: 2008-10-08; RoHS: Y; MountType: SMT; Supplier 1: Digi-Key; LatestRevisionNote: Updated Supplier Data; PackageReference: SOD-323; CompType: Zener; LatestRevisionDate: 2017-03-09; PartNumber: MMSZ5232BS-7-F; AEC Qualified: ?; ComponentLink1Description: Datasheet link; Supplier Part Number 1: MMSZ5232BS-FDICT-ND
D2 = CMP-0028855-1: Diode, Schottky, 40 V, 3 A, AEC-Q101, SMAF; PartNumber: FSV340AF; Manufacturer: Fairchild Semiconductor; SizeAreaWB_mm2: 19.95; SizeArea_mm2: 11.75; AEC Qualified: Y; TJmax_C: 150°C; AEC Category: Q101; SizeZ_mm: 1; Green_REACh: Incomplete; Io_A: 3A; Vf_V: 5dV; SizeY_mm: 2.5; Value2: 0.5V; Green_Lifecycle: Not Set; U/M: EA; SizeX_mm: 4.7; ComponentLink1Description: Datasheet link; RoHS: Y; Supplier 1: Digi-Key; Vr_V: 40V; Green_EU RoHS: Incomplete; PackageReference: SMAF; Value: 40V; Publisher: Texas Instruments; Supplier Part Number 2: 512-FSV340AF; Supplier 2: Mouser; Published: 2008-06-26; LatestRevisionDate: 2017-05-08; ComponentLink1URL: https://www.fairchildsemi.com/datasheets/FS/FSV330AF.pdf; Value1: 3A; CompType: Diode; MountType: SMT; Supplier Part Number 1: FSV340AFCT-ND; Type: Schottky; Green_EU RoHS-2: Incomplete
D3 = CMP-0005415-2: Diode, Zener, 24 V, 1 W, PowerDI123; Manufacturer: Diodes Inc.; Power_W: 1W; SizeAreaWB_mm2: 13.066; RJA_CperW: 110; U/M: EA; Value: 24V; SizeZ_mm: 0.98; SizeX_mm: 3.7; SizeY_mm: 1.78; SizeArea_mm2: 6.586; AEC Category: Q101; Supplier Part Number 2: 621-DFLZ24-7; Publisher: Texas Instruments; Supplier 2: Mouser; Supplier Part Number 3: 2077975; Supplier 3: Farnell; Published: 2008-10-08; RoHS: Y; Value1: 1W; MountType: SMT; Supplier 1: Digi-Key; LatestRevisionNote: Updated Supplier Data; PackageReference: PowerDI123; CompType: Zener; LatestRevisionDate: 2017-03-09; PartNumber: DFLZ24-7; AEC Qualified: ?; ComponentLink1Description: Datasheet link; Supplier Part Number 1: DFLZ24DICT-ND; ComponentLink1URL: http://www.diodes.com/datasheets/ds30464.pdf
D4 = CMP-0029019-1: Diode, Ultrafast, 75 V, 0.25 A, SOD-323; Manufacturer: Central Semiconductor; PartNumber: CMDD4448; Io_A: 2.5dA; Green_Lifecycle: Not Set; SizeAreaWB_mm2: 8.695; Green_REACh: Incomplete; Value1: 0.25A; TJmax_C: 175°C; U/M: EA; SizeZ_mm: 1; SizeX_mm: 2.7; SizeY_mm: 1.35; Vf_V: 1.2V; SizeArea_mm2: 3.645; AEC Category: Q101; ComponentLink1URL: http://www.centralsemi.com/PDFs/products/CMDD4448.PDF; Publisher: Texas Instruments; Vr_V: 75V; Published: 2008-06-26; RoHS: Y; MountType: SMT; Green_EU RoHS-2: Incomplete; Value: 75V; Green_EU RoHS: Incomplete; PackageReference: SOD-323; Value2: 1.2V; CompType: Diode; Type: Ultrafast; LatestRevisionDate: 2017-05-08; AEC Qualified: ?; ComponentLink1Description: Datasheet link; Supplier 1: Digi-Key; Supplier 2: Avnet
L3 = CMP-0063804-1: Inductor, Shielded Drum Core, Ferrite, 10 uH, 1 A, 0.12 ohm, SMD; Manufacturer: Wurth Elektronik; Isat: 1A @ 35% inductance drop; Irms: 1.3A @ 30C rise; Green_Lifecycle: Active; SizeAreaWB_mm2: 33.64; DCR_ohm: 1.2d; Green_REACh: Passed; Value: 10uH; Imax_A: 1A; SizeZ_mm: 1.8; SizeX_mm: 4.8; SizeArea_mm2: 23.04; Ind_H: 10µH; AEC Category: Q200; PackageReference: WE-TPC-M1; ComponentLink1Description: Datasheet link; ComponentLink1URL: http://www.we-online.com/eisos/pdf/744042100.pdf; Supplier Part Number 2: 710-744042100; Publisher: Texas Instruments; Supplier 2: Mouser; Supplier Part Number 3: 1635842; Supplier 3: Farnell; Published: 2008-06-26; RoHS: Y; Value1: 0.12 ohm; Material: Ferrite; MountType: SMT; Green_EU RoHS-2: Incomplete; Supplier 1: Digi-Key; Green_EU RoHS: Passed; SizeY_mm: 4.8; Value2: 1A; CompType: Inductor; LatestRevisionDate: 2017-06-02; PartNumber: 744042100; AEC Qualified: ?; Supplier Part Number 1: 732-1025-1-ND; Technology: Shielded Drum Core
L4 = CMP-0003072-1: Ferrite Bead, 22 ohm @ 100 MHz, 6 A, 0805; Manufacturer: Wurth Elektronik; Ztyp@1GHz_Ohm: 40.219; ZTyp@100MHz_Ohm: 22; SizeAreaWB_mm2: 6.75; DCR_ohm: 8m; Value1: 0.008 ohm; Value: 22 ohm; Imax_A: 6A; SizeZ_mm: 1.45; SizeX_mm: 2; SizeY_mm: 1.25; SizeArea_mm2: 2.5; ComponentLink1URL: http://katalog.we-online.de/pbs/datasheet/742792021.pdf; Supplier Part Number 2: 710-742792021; Publisher: Texas Instruments; Supplier 2: Mouser; Published: 2014-04-30; RoHS: Y; MountType: SMT; Supplier 1: Digi-Key; PackageReference: 0805; Value2: 6A; CompType: Ferrite Bead; LatestRevisionDate: 2017-03-09; PartNumber: 742792021; ComponentLink1Description: Datasheet link; Supplier Part Number 1: 732-4637-1-ND; ValueDisplayed: 22 ohm
R21 R33 = CMP-0021991-3: RES, 100, 1%, 0.1 W, 0603; Manufacturer: Vishay-Dale; Power_W: 100mW; TempCo: 100 ppm/C; Value_Code: 100R; U/M: EA; Value: 100; EIA_Code: E96; SizeX_mm: 1.6; SizeY_mm: 0.8; SizeZ_mm: 1; Value2: 0.1W; SizeArea_mm2: 1.28; CompType: Resistor; VDC_V: 75V; AEC Category: Q200; Supplier Part Number 2: 52K8078; Publisher: Texas Instruments; Supplier 2: Newark; Supplier Part Number 3: 71-CRCW0603-100-E3; Supplier 3: Mouser; Published: 2008-06-26; RoHS: Y; Value1: 1%; MountType: SMT; Supplier 1: Digi-Key; PackageReference: 0603; Tolerance_%: 1%; Res_ohm: 100; LatestRevisionDate: 2017-03-09; PartNumber: CRCW0603100RFKEA; AEC Qualified: ?; ComponentLink1Description: Datasheet link; Supplier Part Number 1: 541-100HCT-ND; Technology: Thick Film; ComponentLink1URL: http://www.vishay.com/docs/20035/dcrcwe3.pdf
R39 = CMP-0022064-4: RES, 158 k, 1%, 0.1 W, AEC-Q200 Grade 0, 0603; Manufacturer: Vishay-Dale; Power_W: 100mW; TempCo: 100 ppm/C; Value: 158k; EIA_Code: E96; SizeX_mm: 1.6; SizeY_mm: 0.8; SizeZ_mm: 1; Value2: 0.1W; SizeArea_mm2: 1.28; CompType: Resistor; AEC Qualified: Y; VDC_V: 75V; AEC Category: Q200; AEC Grade: 0; ComponentLink1URL: http://www.vishay.com/docs/20035/dcrcwe3.pdf; Supplier Part Number 2: 52K8164; Supplier 2: Newark; Supplier Part Number 3: 71-CRCW0603-158K-E3; Supplier 3: Mouser; Value_Code: 158k; RoHS: E; Value1: 1%; MountType: SMT; Supplier 1: Digi-Key; PackageReference: 0603; Tolerance_%: 1%; Res_ohm: 158k; PartNumber: CRCW0603158KFKEA; ComponentLink1Description: Datasheet link; Supplier Part Number 1: 541-158KHCT-ND; Technology: Thick Film
R44 = CMP-0022036-4: RES, 130 k, 1%, 0.1 W, AEC-Q200 Grade 0, 0603; Manufacturer: Vishay-Dale; Power_W: 100mW; TempCo: 100 ppm/C; Value: 130k; EIA_Code: E96; SizeX_mm: 1.6; SizeY_mm: 0.8; SizeZ_mm: 1; Value2: 0.1W; SizeArea_mm2: 1.28; CompType: Resistor; AEC Qualified: Y; VDC_V: 75V; AEC Category: Q200; AEC Grade: 0; Supplier Part Number 2: 52K8127; Supplier 2: Newark; Supplier Part Number 3: 71-CRCW0603-130K-E3; Supplier 3: Mouser; Value_Code: 130k; RoHS: E; Value1: 1%; MountType: SMT; Supplier 1: Digi-Key; PackageReference: 0603; Tolerance_%: 1%; Res_ohm: 130k; PartNumber: CRCW0603130KFKEA; ComponentLink1Description: Datasheet link; Supplier Part Number 1: 541-130KHCT-ND; Technology: Thick Film; ComponentLink1URL: http://www.vishay.com/docs/20035/dcrcwe3.pdf
R45 = CMP-0022030-3: RES, 12.1 k, 1%, 0.1 W, 0603; Manufacturer: Vishay-Dale; Power_W: 100mW; TempCo: 100 ppm/C; Value_Code: 12k1; U/M: EA; Value: 12.1k; EIA_Code: E96; SizeX_mm: 1.6; SizeY_mm: 0.8; SizeZ_mm: 1; Value2: 0.1W; SizeArea_mm2: 1.28; CompType: Resistor; VDC_V: 75V; AEC Category: Q200; Supplier Part Number 2: 52K8105; Publisher: Texas Instruments; Supplier 2: Newark; Supplier Part Number 3: 71-CRCW0603-12.1K-E3; Supplier 3: Mouser; Published: 2008-06-26; RoHS: Y; Value1: 1%; MountType: SMT; Supplier 1: Digi-Key; PackageReference: 0603; Tolerance_%: 1%; LatestRevisionDate: 2017-03-09; PartNumber: CRCW060312K1FKEA; AEC Qualified: ?; ComponentLink1Description: Datasheet link; Supplier Part Number 1: 541-12.1KHCT-ND; Technology: Thick Film; Res_ohm: 12.1k; ComponentLink1URL: http://www.vishay.com/docs/20035/dcrcwe3.pdf
T1 = CMP-0085524-1: Transformer, 30 uH, SMD; Manufacturer: Coilcraft; SizeAreaWB_mm2: 137.86; SizeArea_mm2: 94.86; AEC Qualified: N; Lp: 30; AEC Category: Q200; Value: 30uH; SizeZ_mm: 10.6; Ind_H: 30µH; SizeY_mm: 10.2; Ns1toNp: 0.33; Rsec1_ohm: 0.025; DCR_ohm: 0.014; SizeX_mm: 9.3; LeakageInd_H: 380nH; ComponentLink1Description: Datasheet URL; RoHS: Y; PackageReference: 9.3x10.2mm; PartNumber: YA8779-BL; AEC Grade: N/A; ComponentLink1URL: https://sps16.itg.ti.com/sites/KMS/crossdivteams/altium/docs/ComponentDatasheets/YA8779-BL -- 5V single output.pdf; CompType: Transformer; MountType: SMT; ValueDisplayed: 30µH; Ns2toNp: 0.33; Rsec2_ohm: 0.025
TP9 = CMP-0055152-1: Test Point, Miniature, SMT; Manufacturer: Keystone; PartNumber: 5015; CNHeader: FALSE; Green_Lifecycle: Active; Green_REACh: Passed; CT: TRUE; ComponentLink1URL: http://www.keyelco.com/userAssets/store/files/5015.PDF; Supplier Part Number 2: 534-5015; Publisher: Texas Instruments; Supplier 2: Mouser; RoHS: Y; MountType: SMT; Green_EU RoHS-2: Incomplete; Supplier 1: Digi-Key; Green_EU RoHS: Passed; PackageReference: Testpoint_Keystone_Miniature; CompType: Test Point; LatestRevisionDate: 26/05/2017; ComponentLink1Description: Datasheet URL; Supplier Part Number 1: 36-5015TR-ND
U12 = CMP-0078633-2: 70-V PSR Flyback Converter With 100-V, 1.2-A Power Switch and Ultra-Low IQ, NGU0008C (WSON-8); Alternate PartNumber: LM5180QNGUTQ1; Alternate Manufacturer: Texas Instruments; Alternate Manufacturer: None; SizeAreaWB_mm2: 25; SizeZ_mm: 0.8; SizeX_mm: 4; SizeArea_mm2: 16; CompType: IC; AEC Qualified: Y; AEC Category: Q200; ComponentLink1URL: http://www.ti.com/lit/ds/symlink/lm5180-q1.pdf; PackageDescription: WSON-8; MountType: SMT; ComponentLink2URL: http://www.ti.com/product/lm5180-q1; ComponentLink2Description: Product Folder; Manufacturer: Texas Instruments; PackageReference: NGU0008C; SizeY_mm: 4; PartNumber: LM5180QNGURQ1; ComponentLink1Description: Datasheet Link

## Nets that join several sheets
+3.3V_0: FPGA_SPI_interface (C134.2 SV2.2), mcu0_primary (7 pins), ext_bootload_activation (R78.2 T5.2 X10.1), power (42 pins), mcu0_to_mcu1_isolated_SPI (C70.2 U14.16), connector_to_BMS_extension (JP1.2 JP1.4 JP2.2 JP2.4), interlock_circuit (U21.4 U24.1), contactor_control (6 pins), isolated_rs485 (C146.1 C148.1 U34.1)
+3.3V_1: mcu0_to_mcu1_isolated_SPI (C56.1 U14.1), mcu1_secondary (28 pins), interlock_circuit (U8.4 U11.1)
+3.3V_COM: hierarchy (X13.5 X16.6), isolated_rs485 (C144.1 C147.1 U34.16)
+5.0V_0: FPGA_SPI_interface (C128.1 SV2.1), mcu0_primary (LS1.1 R137.2), power (R117.2)
EXT_+3.3V_0: hierarchy (X12.3), contactor_control (14 pins)
GND: dcdc_5v0_3v3 (10 pins), dcdc_wide_3v3 (13 pins)
GND_0: FPGA_SPI_interface (C128.2 C134.1 SV2.5 SV2.6), mcu0_primary (19 pins), debug_LED (R60.1 R61.1), ext_bootload_activation (R95.1), power (47 pins), mcu0_to_mcu1_isolated_SPI (C70.1 U14.9), connector_to_BMS_extension (JP1.1 JP1.3 JP2.1 JP2.3), interlock_circuit (R84.1 R86.2 T6.S), contactor_control (7 pins), isolated_rs485 (C146.2 C148.2 U34.2,8 U34.8)
GND_1: mcu0_to_mcu1_isolated_SPI (C56.2 U14.8), mcu1_secondary (39 pins), interlock_circuit (R35.1 R41.2 T3.S)
GND_COM: hierarchy (X12.6 X13.2 X16.1), interlock_circuit (7 pins), contactor_control (32 pins), isolated_rs485 (6 pins)
SUPPLY_ext: interlock_circuit (SV3.5 SV3.7 U18.7 U18.8), contactor_control (X11.9 X11.11 X11.13 X11.15)
ABEXT_N: hierarchy (X16.2), isolated_rs485 (R120.1 U37.2)
ABEXT_P: hierarchy (X16.5), isolated_rs485 (R118.1 U37.1)
ADC_MCU_0_CH_0: mcu0_primary (U26.54), connector_to_BMS_extension (JP1.7)
ADC_MCU_0_CH_1: mcu0_primary (U26.55), connector_to_BMS_extension (JP1.8)
ADC_MCU_0_CH_2: mcu0_primary (U26.56), connector_to_BMS_extension (JP1.5)
ADC_MCU_0_CH_3: mcu0_primary (U26.57), connector_to_BMS_extension (JP1.6)
ADC_MCU_0_CH_4: mcu0_primary (U26.41), connector_to_BMS_extension (JP1.10)
BOOT_0_MCU_0: mcu0_primary (U26.166), ext_bootload_activation (R95.2 T5.3 X10.2)
CONTACTOR_0_CONTROL: mcu0_primary (U26.131), contactor_control (U23.5)
CONTACTOR_0_FEEDBACK: mcu0_primary (U26.130), contactor_control (U25.12)
CONTACTOR_1_CONTROL: mcu0_primary (U26.132), contactor_control (U23.4)
CONTACTOR_1_FEEDBACK: mcu0_primary (U26.129), contactor_control (U25.13)
CONTACTOR_2_CONTROL: mcu0_primary (U26.133), contactor_control (U23.3)
CONTACTOR_2_FEEDBACK: mcu0_primary (U26.128), contactor_control (U25.14)
CONTACTOR_3_CONTROL: mcu0_primary (U26.134), contactor_control (U23.2)
CONTACTOR_3_FEEDBACK: mcu0_primary (U26.117), contactor_control (U25.15)
CONTACTOR_6_CONTROL: mcu0_primary (U26.139), connector_to_BMS_extension (JP2.17)
CONTACTOR_6_FEEDBACK: mcu0_primary (U26.140), connector_to_BMS_extension (JP2.18)
CONTACTOR_7_CONTROL: mcu0_primary (U26.144), connector_to_BMS_extension (JP2.15)
CONTACTOR_7_FEEDBACK: mcu0_primary (U26.164), connector_to_BMS_extension (JP2.16)
CONTACTOR_8_CONTROL: mcu0_primary (U26.44), connector_to_BMS_extension (JP1.9)
CONTACTOR_8_FEEDBACK: mcu0_primary (U26.45), connector_to_BMS_extension (JP1.12)
CONTACTOR_SUPPLY_FAULT: mcu0_primary (U26.116), contactor_control (U25.11)
CONTACTOR_SUPPLY_SHDN: mcu0_primary (U26.115), contactor_control (R88.2 U25.10)
DEBUG_LED_0_MCU_0: mcu0_primary (U26.35), debug_LED (LED4.2)
DEBUG_LED_1_MCU_0: mcu0_primary (U26.34), debug_LED (LED5.2)
GPIO.RTC_INT#: mcu0_primary (U26.40), power (R126.1 U40.7)
I2C3.SCL: mcu0_primary (R128.1 U26.119), power (U36.7 U40.6)
I2C3.SDA: mcu0_primary (R127.1 U26.118), power (U36.6 U40.5)
INTERLOCK_CONTROL_MCU_0: mcu0_primary (U26.146), interlock_circuit (R85.2)
INTERLOCK_CONTROL_MCU_1: mcu1_secondary (U2.85), interlock_circuit (R40.2)
INTERLOCK_FEEDBACK_MCU_0: mcu0_primary (U26.147), interlock_circuit (R84.2 U21.3)
INTERLOCK_FEEDBACK_MCU_1: mcu1_secondary (U2.86), interlock_circuit (R35.2 U8.3)
INTERLOCK_STATUS: interlock_circuit (D6.1 R52.2 SV3.1 X6.1), contactor_control (R70.2)
ISO_GPIO_MCU_0_IN_0: mcu0_primary (U26.100), connector_to_BMS_extension (JP1.21)
ISO_GPIO_MCU_0_IN_1: mcu0_primary (U26.101), connector_to_BMS_extension (JP1.24)
ISO_GPIO_MCU_0_IN_2: mcu0_primary (U26.154), connector_to_BMS_extension (JP2.14)
ISO_GPIO_MCU_0_IN_3: mcu0_primary (U26.173), connector_to_BMS_extension (JP2.9)
ISO_GPIO_MCU_0_OUT_0: mcu0_primary (U26.152), connector_to_BMS_extension (JP2.10)
ISO_GPIO_MCU_0_OUT_1: mcu0_primary (U26.153), connector_to_BMS_extension (JP2.13)
ISO_GPIO_MCU_0_OUT_2: mcu0_primary (U26.174), connector_to_BMS_extension (JP2.12)
ISO_GPIO_MCU_0_OUT_3: mcu0_primary (U26.175), connector_to_BMS_extension (JP2.11)
ISONOC_0_CONTROL: mcu0_primary (U26.85), connector_to_BMS_extension (JP1.15)
ISONOC_1_CONTROL: mcu0_primary (U26.86), connector_to_BMS_extension (JP1.18)
ISONOC_2_CONTROL: mcu0_primary (U26.87), connector_to_BMS_extension (JP1.17)
ISONOC_3_CONTROL: mcu0_primary (U26.88), connector_to_BMS_extension (JP1.20)
ISONOC_4_CONTROL: mcu0_primary (U26.89), connector_to_BMS_extension (JP1.19)
ISONOC_5_CONTROL: mcu0_primary (U26.99), connector_to_BMS_extension (JP1.22)
MCU_TO_FPGA_INTERFACE_MCU_0_CS: FPGA_SPI_interface (SV2.7), mcu0_primary (U26.24)
MCU_TO_FPGA_INTERFACE_MCU_0_MISO: FPGA_SPI_interface (SV2.4), mcu0_primary (U26.26)
MCU_TO_FPGA_INTERFACE_MCU_0_MOSI: FPGA_SPI_interface (SV2.8), mcu0_primary (U26.27)
MCU_TO_FPGA_INTERFACE_MCU_0_SCK: FPGA_SPI_interface (SV2.3), mcu0_primary (U26.25)
MCU_TO_MCU_INTERFACE_MCU_0_CS: mcu0_primary (U26.163), mcu0_to_mcu1_isolated_SPI (U14.13)
MCU_TO_MCU_INTERFACE_MCU_0_MISO: mcu0_primary (U26.94), mcu0_to_mcu1_isolated_SPI (U14.11)
MCU_TO_MCU_INTERFACE_MCU_0_MOSI: mcu0_primary (U26.95), mcu0_to_mcu1_isolated_SPI (U14.15)
MCU_TO_MCU_INTERFACE_MCU_0_SCK: mcu0_primary (U26.145), mcu0_to_mcu1_isolated_SPI (U14.14)
MCU_TO_MCU_INTERFACE_MCU_1_CS: mcu0_to_mcu1_isolated_SPI (U14.4), mcu1_secondary (U2.51)
MCU_TO_MCU_INTERFACE_MCU_1_MISO: mcu0_to_mcu1_isolated_SPI (U14.6), mcu1_secondary (U2.53)
MCU_TO_MCU_INTERFACE_MCU_1_MOSI: mcu0_to_mcu1_isolated_SPI (U14.2), mcu1_secondary (U2.54)
MCU_TO_MCU_INTERFACE_MCU_1_SCK: mcu0_to_mcu1_isolated_SPI (U14.3), mcu1_secondary (U2.84)
RS485_DE: mcu0_primary (U26.107), isolated_rs485 (LSP4.1 U34.5)
RS485_MCU_0_NRE: mcu0_primary (U26.106), isolated_rs485 (LSP3.1 U34.4)
RS485_MCU_0_RX: mcu0_primary (U26.121), isolated_rs485 (LSP2.1 U34.3)
RS485_MCU_0_TX: mcu0_primary (U26.120), isolated_rs485 (LSP5.1 U34.6)
RS485_YZ_N: hierarchy (X16.3), isolated_rs485 (R121.1 U35.1)
RS485_YZ_P: hierarchy (X16.4), isolated_rs485 (R122.1 U35.2)

## Assembly variants
default: not fitted D19 JP1 JP2 R130 SV1 SV2 SV3 X3 X5 X8 X9 X10